# EAGLE schematic Adder_1.1 (EAGLE 7.6.0)
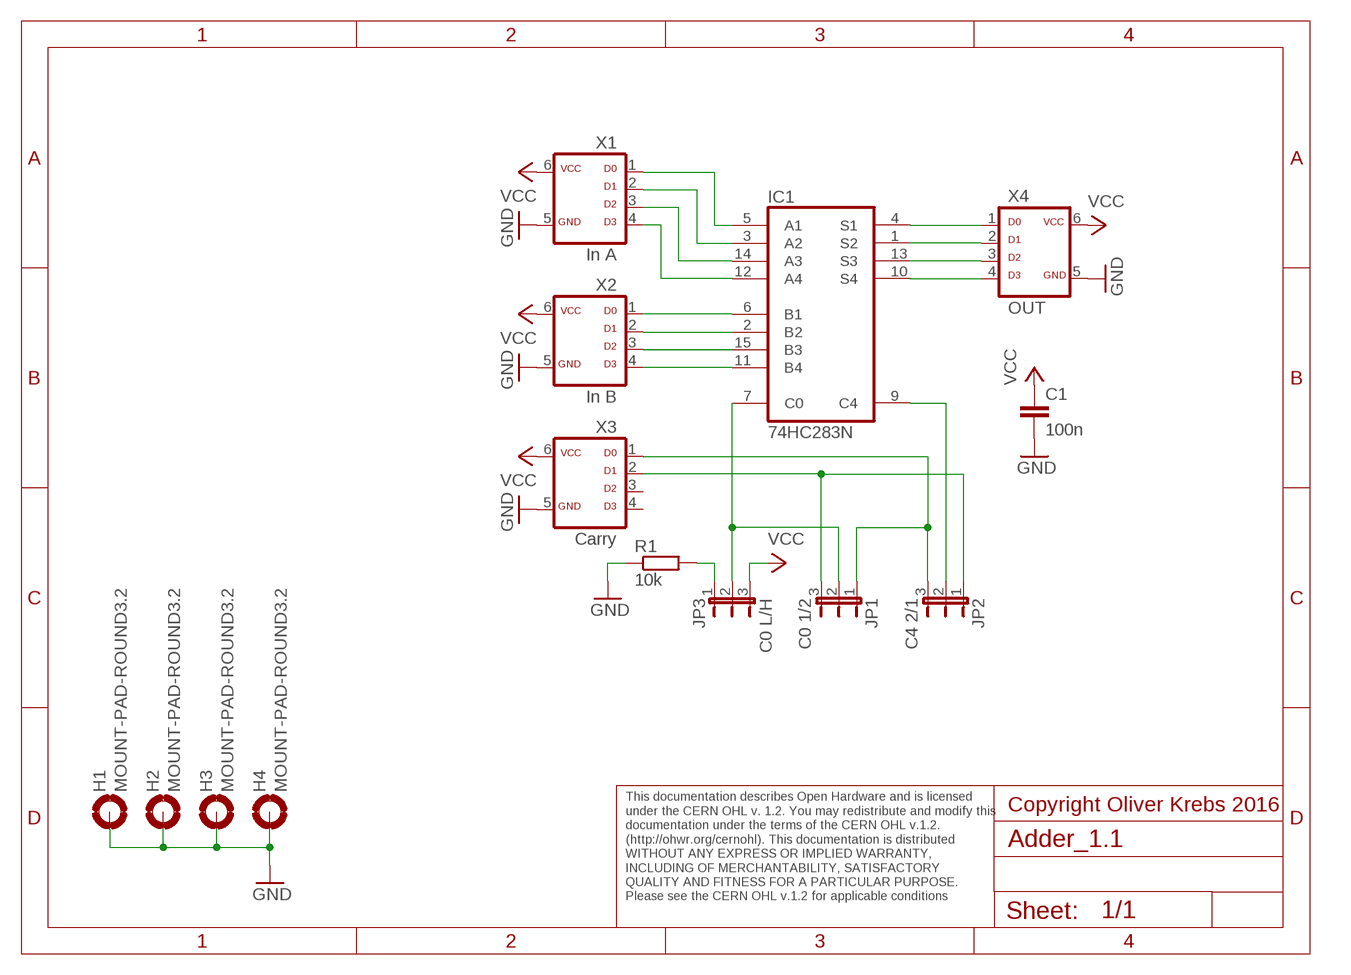
[diagram p0: schematic, sheet 1]

## Parts
C1  100n  C-EU050-025X075  [C050-025X075]
H1  MOUNT-PAD-ROUND3.2  [3,2-PAD]
H2  MOUNT-PAD-ROUND3.2  [3,2-PAD]
H3  MOUNT-PAD-ROUND3.2  [3,2-PAD]
H4  MOUNT-PAD-ROUND3.2  [3,2-PAD]
IC1  74HC283N  [DIL16]
JP1  C0 1/2  JP2E  [JP2]
JP2  C4 2/1  JP2E  [JP2]
JP3  C0 L/H  JP2E  [JP2]
R1  10k  R-EU_0207/10  [0207/10]
X1  In A  ML6D  [ML-6]
X2  In B  ML6D  [ML-6]
X3  Carry  ML6D  [ML-6]
X4  OUT  ML6D  [ML-6]

## Nets
GND: C1.2 H1.B3,2(MOUNT) H2.B3,2(MOUNT) H3.B3,2(MOUNT) H4.B3,2(MOUNT) R1.1 X1.5 X2.5 X3.5 X4.5
N$1: JP3.1 R1.2
N$2: IC1.15(B3) X2.3
N$3: IC1.3(A2) X1.2
N$5: IC1.2(B2) X2.2
N$6: IC1.14(A3) X1.3
N$8: IC1.11(B4) X2.4
N$9: IC1.1(S2) X4.2
N$10: IC1.4(S1) X4.1
N$11: IC1.13(S3) X4.3
N$12: IC1.10(S4) X4.4
N$13: IC1.7(C0) JP1.2 JP3.2
N$14: IC1.9(C4) JP2.2
N$15: JP1.1 JP2.3 X3.1
N$16: JP1.3 JP2.1 X3.2
N$20: IC1.5(A1) X1.1
N$22: IC1.12(A4) X1.4
N$24: IC1.6(B1) X2.1
VCC: C1.1 JP3.3 X1.6 X2.6 X3.6 X4.6
Unconnected: X3.3 X3.4

## Notes on the sheet
- Copyright Oliver Krebs 2016
- This documentation describes Open Hardware and is licensed 
  under the CERN OHL v. 1.2. You may redistribute and modify this 
  documentation under the terms of the CERN OHL v.1.2. 
  (http://ohwr.org/cernohl). This documentation is distributed
  WITHOUT ANY EXPRESS OR IMPLIED WARRANTY, 
  INCLUDING OF MERCHANTABILITY, SATISFACTORY 
  QUALITY AND FITNESS FOR A PARTICULAR PURPOSE. 
  Please see the CERN OHL v.1.2 for applicable conditions

## Power pins joined to a net without a drawn wire
GND: IC1.8(GND)
VCC: IC1.16(VCC)

## Library data of the parts
C1 = 01-my_rcl:C-EU: CAPACITOR, European symbol
H1-H4 = holes:MOUNT-PAD-ROUND: MOUNTING PAD, round
IC1 = 74xx-eu:74*283: 4-bit binary FULL ADDER, fast carry
JP1-JP3 = jumper:JP2E: JUMPER
R1 = 01-my_rcl:R-EU_: RESISTOR, European symbol
X1-X4 = 01-my-con:ML6D